# Altium schematic sheet drvoutput0.SchDoc
size A4
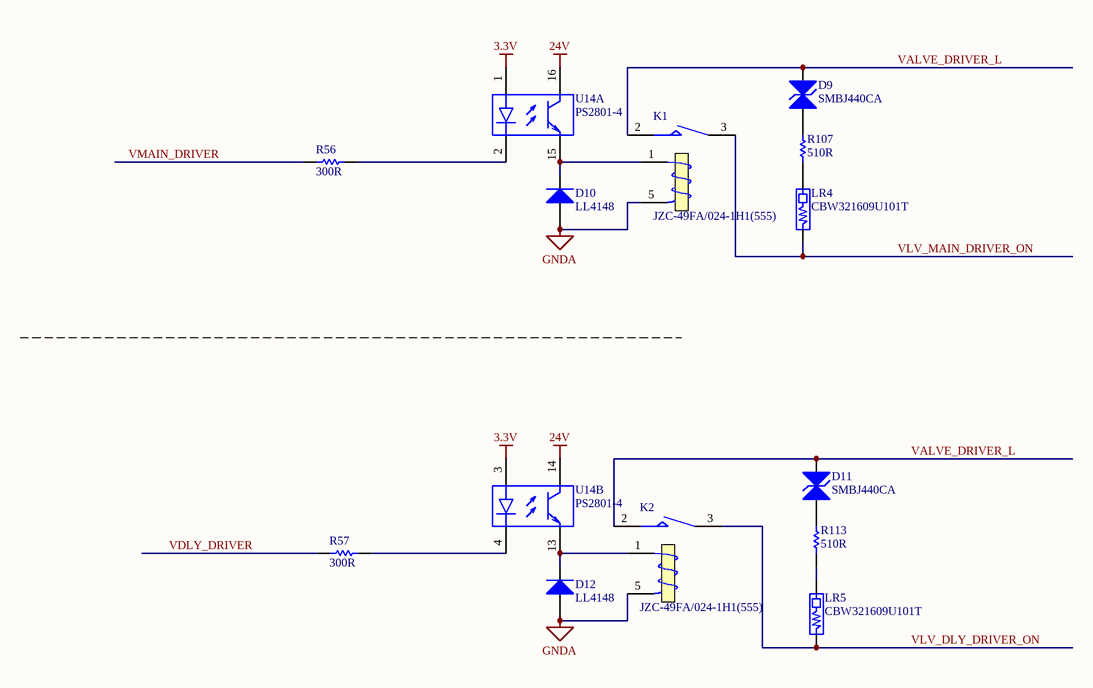
[diagram p0: drvoutput0.SchDoc]

## Parts
D9  SMBJ440CA  [SMB]
D10  LL4148  [CD2012-0805]
D11  SMBJ440CA  [SMB]
D12  LL4148  [CD2012-0805]
K1  JZC-49FA/024-1H1(555)  [JZC-49FA]
K2  JZC-49FA/024-1H1(555)  [JZC-49FA]
LR4  CBW321609U101T  [INDC3216M]
LR5  CBW321609U101T  [INDC3216M]
R56  300R  [RESC2012M]
R57  300R  [RESC2012M]
R107  510R  [RESC3216M]
R113  510R  [RESC3216M]
U14  PS2801-4  [SOIC16_N]  (parts A,B of 4)

## Nets
3.3V: U14.1(+) U14.3(+)
24V: U14.14(C) U14.16(C)
GNDA: D10.1(A) D12.1(A) K1.5(T2) K2.5(T2)
VALVE_DRIVER_L: D9.2(K) D11.2(K) K1.2(COM) K2.2(COM)
VDLY_DRIVER: R57.1
VLV_DLY_DRIVER_ON: K2.3(NO) LR5.1
VLV_MAIN_DRIVER_ON: K1.3(NO) LR4.1
VMAIN_DRIVER: R56.1
NetD9_1: D9.1(A) R107.2
NetD10_2: D10.2(K) K1.1 U14.15(E)
NetD11_1: D11.1(A) R113.2
NetD12_2: D12.2(K) K2.1 U14.13(E)
NetLR4_2: LR4.2 R107.1
NetLR5_2: LR5.2 R113.1
NetR56_2: R56.2 U14.2(-)
NetR57_2: R57.2 U14.4(-)

## Library data of the parts
D9 D11 = Bi-dir TVS Diode: Published: 8-Jun-2000; LatestRevisionDate: 17-Jul-2002; LatestRevisionNote: Re-released for DXP Platform.; PackageReference: DIODE-0.7; Publisher: Altium Limited
D10 D12 = Diode 1N4007: 1 Amp General Purpose Rectifier; Published: 8-Jun-2000; LatestRevisionDate: 17-Jul-2002; LatestRevisionNote: Re-released for DXP Platform.; DatasheetVersion: 1998; PackageVersion: Aug-1999; PackageReference: DO-41; Publisher: Altium Limited; Code_JEDEC: DO-204-AL; ComponentLink1Description: Manufacturer Link; ComponentLink1URL: http://www.fairchildsemi.com/; ComponentLink2Description: Datasheet; ComponentLink2URL: http://www.fairchildsemi.com/ds/1N%2F1N4001.pdf
K1 K2 = JZC-49FA: Intermediate  Power  Relay; Published: 8-Jun-2000; LatestRevisionDate: 17-Jul-2002; LatestRevisionNote: Re-released for DXP Platform.; PackageReference: MODULE5B; Publisher: Altium Limited
LR4 LR5 = BLM10/11/21/31/41: EMI FILTERS,DC Resistance max.0.05~1.5 ohms,10 ~ 1000 ohms at 100MHz  Frequency
R56 R57 = Res1: Resistor; Value: 10K; Published: 8-Jun-2000; LatestRevisionDate: 17-Jul-2002; LatestRevisionNote: Re-released for DXP Platform.; PackageReference: AXIAL-0.3; Publisher: Altium Limited
R107 R113 = Res1: Metal film Resistor; Value: 10K; Published: 8-Jun-2000; LatestRevisionDate: 17-Jul-2002; LatestRevisionNote: Re-released for DXP Platform.; PackageReference: AXIAL-0.3; Publisher: Altium Limited
U14 = PS2801-4: The PS2801-1 and PS2801-4 are optically coupled isolators containing a GaAs light emitting diode and an NPN  silicon phototransistor in a plastic SOP for high density applications.; Published: 28-Feb-2003; LatestRevisionDate: 13-Apr-2006; LatestRevisionNote: IPC-7351 Footprint Added.; DatasheetVersion: Jan-2002, Rev. 7; PackageVersion: rev7, Jan-2002; PackageReference: 751-07; Publisher: Altium Limited; PackageDescription: 8-Pin Plastic Small Outline Integrated Circuit 1.27 mm Pitch; Code_JEDEC: MS-012-AA; Code_IPC: SOIC127P600-8; ComponentLink1Description: Manufacturer Link; ComponentLink1URL: http://www.onsemi.com/; ComponentLink2Description: Datasheet; ComponentLink2URL: http://www.onsemi.com/pub/Collateral/LM358-D.PDF